# Altium schematic sheet NRF24L01_PA_LNA.SchDoc
size A4
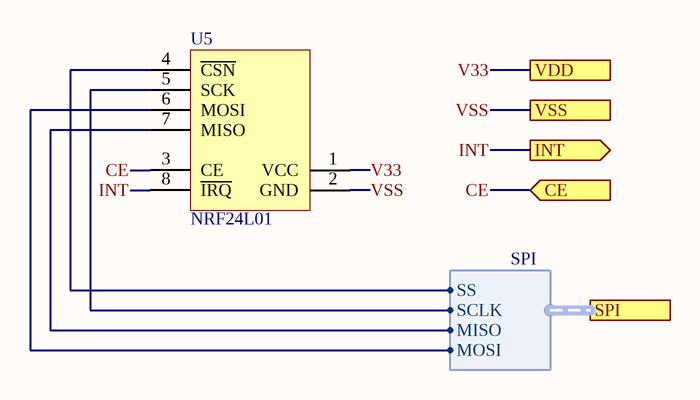
[diagram p0: NRF24L01_PA_LNA.SchDoc]

## Parts
U5  NRF24L01  [NRF24L01P+PA+LNA+IPX]

## Ports
CE (in), INT (out), SPI (harness SPI), VDD, VSS

## Harnesses
SPI: SS, MISO, MOSI, SCLK

## Nets
CE: U5.3(CE) ; port CE
INT: U5.8(~{IRQ}) ; port INT
V33: U5.1(VCC) ; port VDD
VSS: U5.2(GND) ; port VSS
NetU5_4: U5.4(~{CSN}) ; port SPI.SS
NetU5_5: U5.5(SCK) ; port SPI.SCLK
NetU5_6: U5.6(MOSI) ; port SPI.MOSI
NetU5_7: U5.7(MISO) ; port SPI.MISO

## Library data of the parts
U5 = NRF24L01_module: pin to pad: 2>8 3>2 4>3 5>4 6>5 7>6 8>7